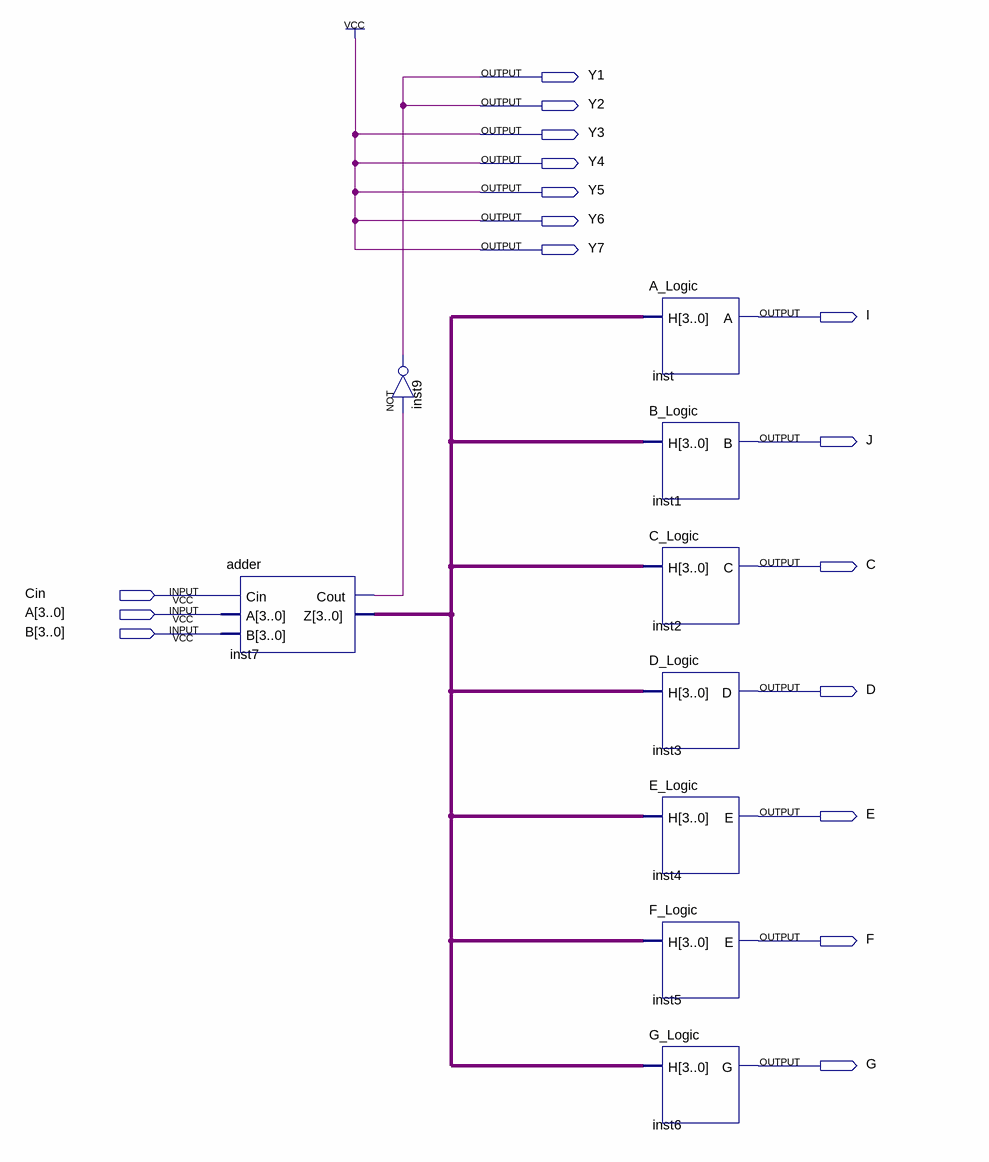
[diagram p0: schematic sheet]
// Quartus schematic LAB3.bdf as structural Verilog: 9 symbols, 17 pins
module LAB3 (
  input  Cin,
  input  [3:0] A,
  input  [3:0] B,
  output Y1,
  output Y2,
  output Y3,
  output Y4,
  output Y5,
  output Y6,
  output Y7,
  output I,
  output J,
  output C,
  output D,
  output E,
  output F,
  output G
);

  wire inst7_cout;
  wire [3:0] inst7_z;

  adder inst7 (.Cin(Cin), .A(A), .B(B), .Cout(inst7_cout), .Z(inst7_z));
  not inst9 (Y1, inst7_cout);
  A_Logic inst (.H(inst7_z), .A(I));
  B_Logic inst1 (.H(inst7_z), .B(J));
  C_Logic inst2 (.H(inst7_z), .C(C));
  D_Logic inst3 (.H(inst7_z), .D(D));
  E_Logic inst4 (.H(inst7_z), .E(E));
  F_Logic inst5 (.H(inst7_z), .E(F));
  G_Logic inst6 (.H(inst7_z), .G(G));

  assign Y2 = Y1;
  assign Y3 = 1'b1;
  assign Y4 = 1'b1;
  assign Y5 = 1'b1;
  assign Y6 = 1'b1;
  assign Y7 = 1'b1;
endmodule
